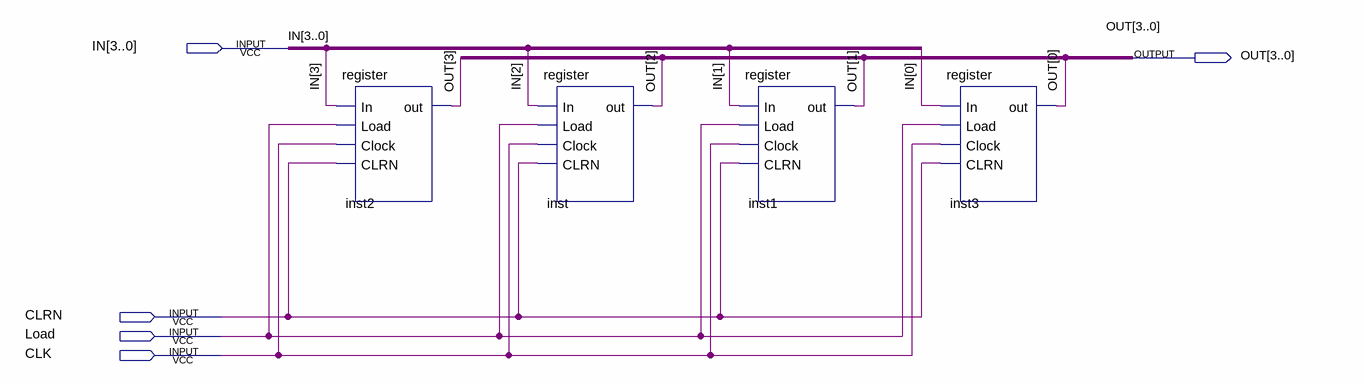
[diagram p0: schematic sheet]
// Quartus schematic reg4b.bdf as structural Verilog: 4 symbols, 5 pins
module reg4b (
  input  [3:0] IN,
  input  CLRN,
  input  Load,
  input  CLK,
  output [3:0] OUT
);

  register inst2 (.In(IN[3]), .Load(Load), .Clock(CLK), .CLRN(CLRN), .out(OUT[3]));
  register inst (.In(IN[2]), .Load(Load), .Clock(CLK), .CLRN(CLRN), .out(OUT[2]));
  register inst1 (.In(IN[1]), .Load(Load), .Clock(CLK), .CLRN(CLRN), .out(OUT[1]));
  register inst3 (.In(IN[0]), .Load(Load), .Clock(CLK), .CLRN(CLRN), .out(OUT[0]));
endmodule
